# EasyEDA Pro project ProDocument_20LEDBarGraph_2024-07-22.epro

# Schematic Schematic1
Create Date: 2024-06-02; Page Name: P1; Project Name: 20BarLedGraph; Schematic Name: Schematic1; Update Date: 2024-06-02; Company: EasyEDA.com; Drawn: EasyEDA; Page Size: B4; Part Number: JLCPCB-002; Reviewed: EasyEDA; Version: V0.1
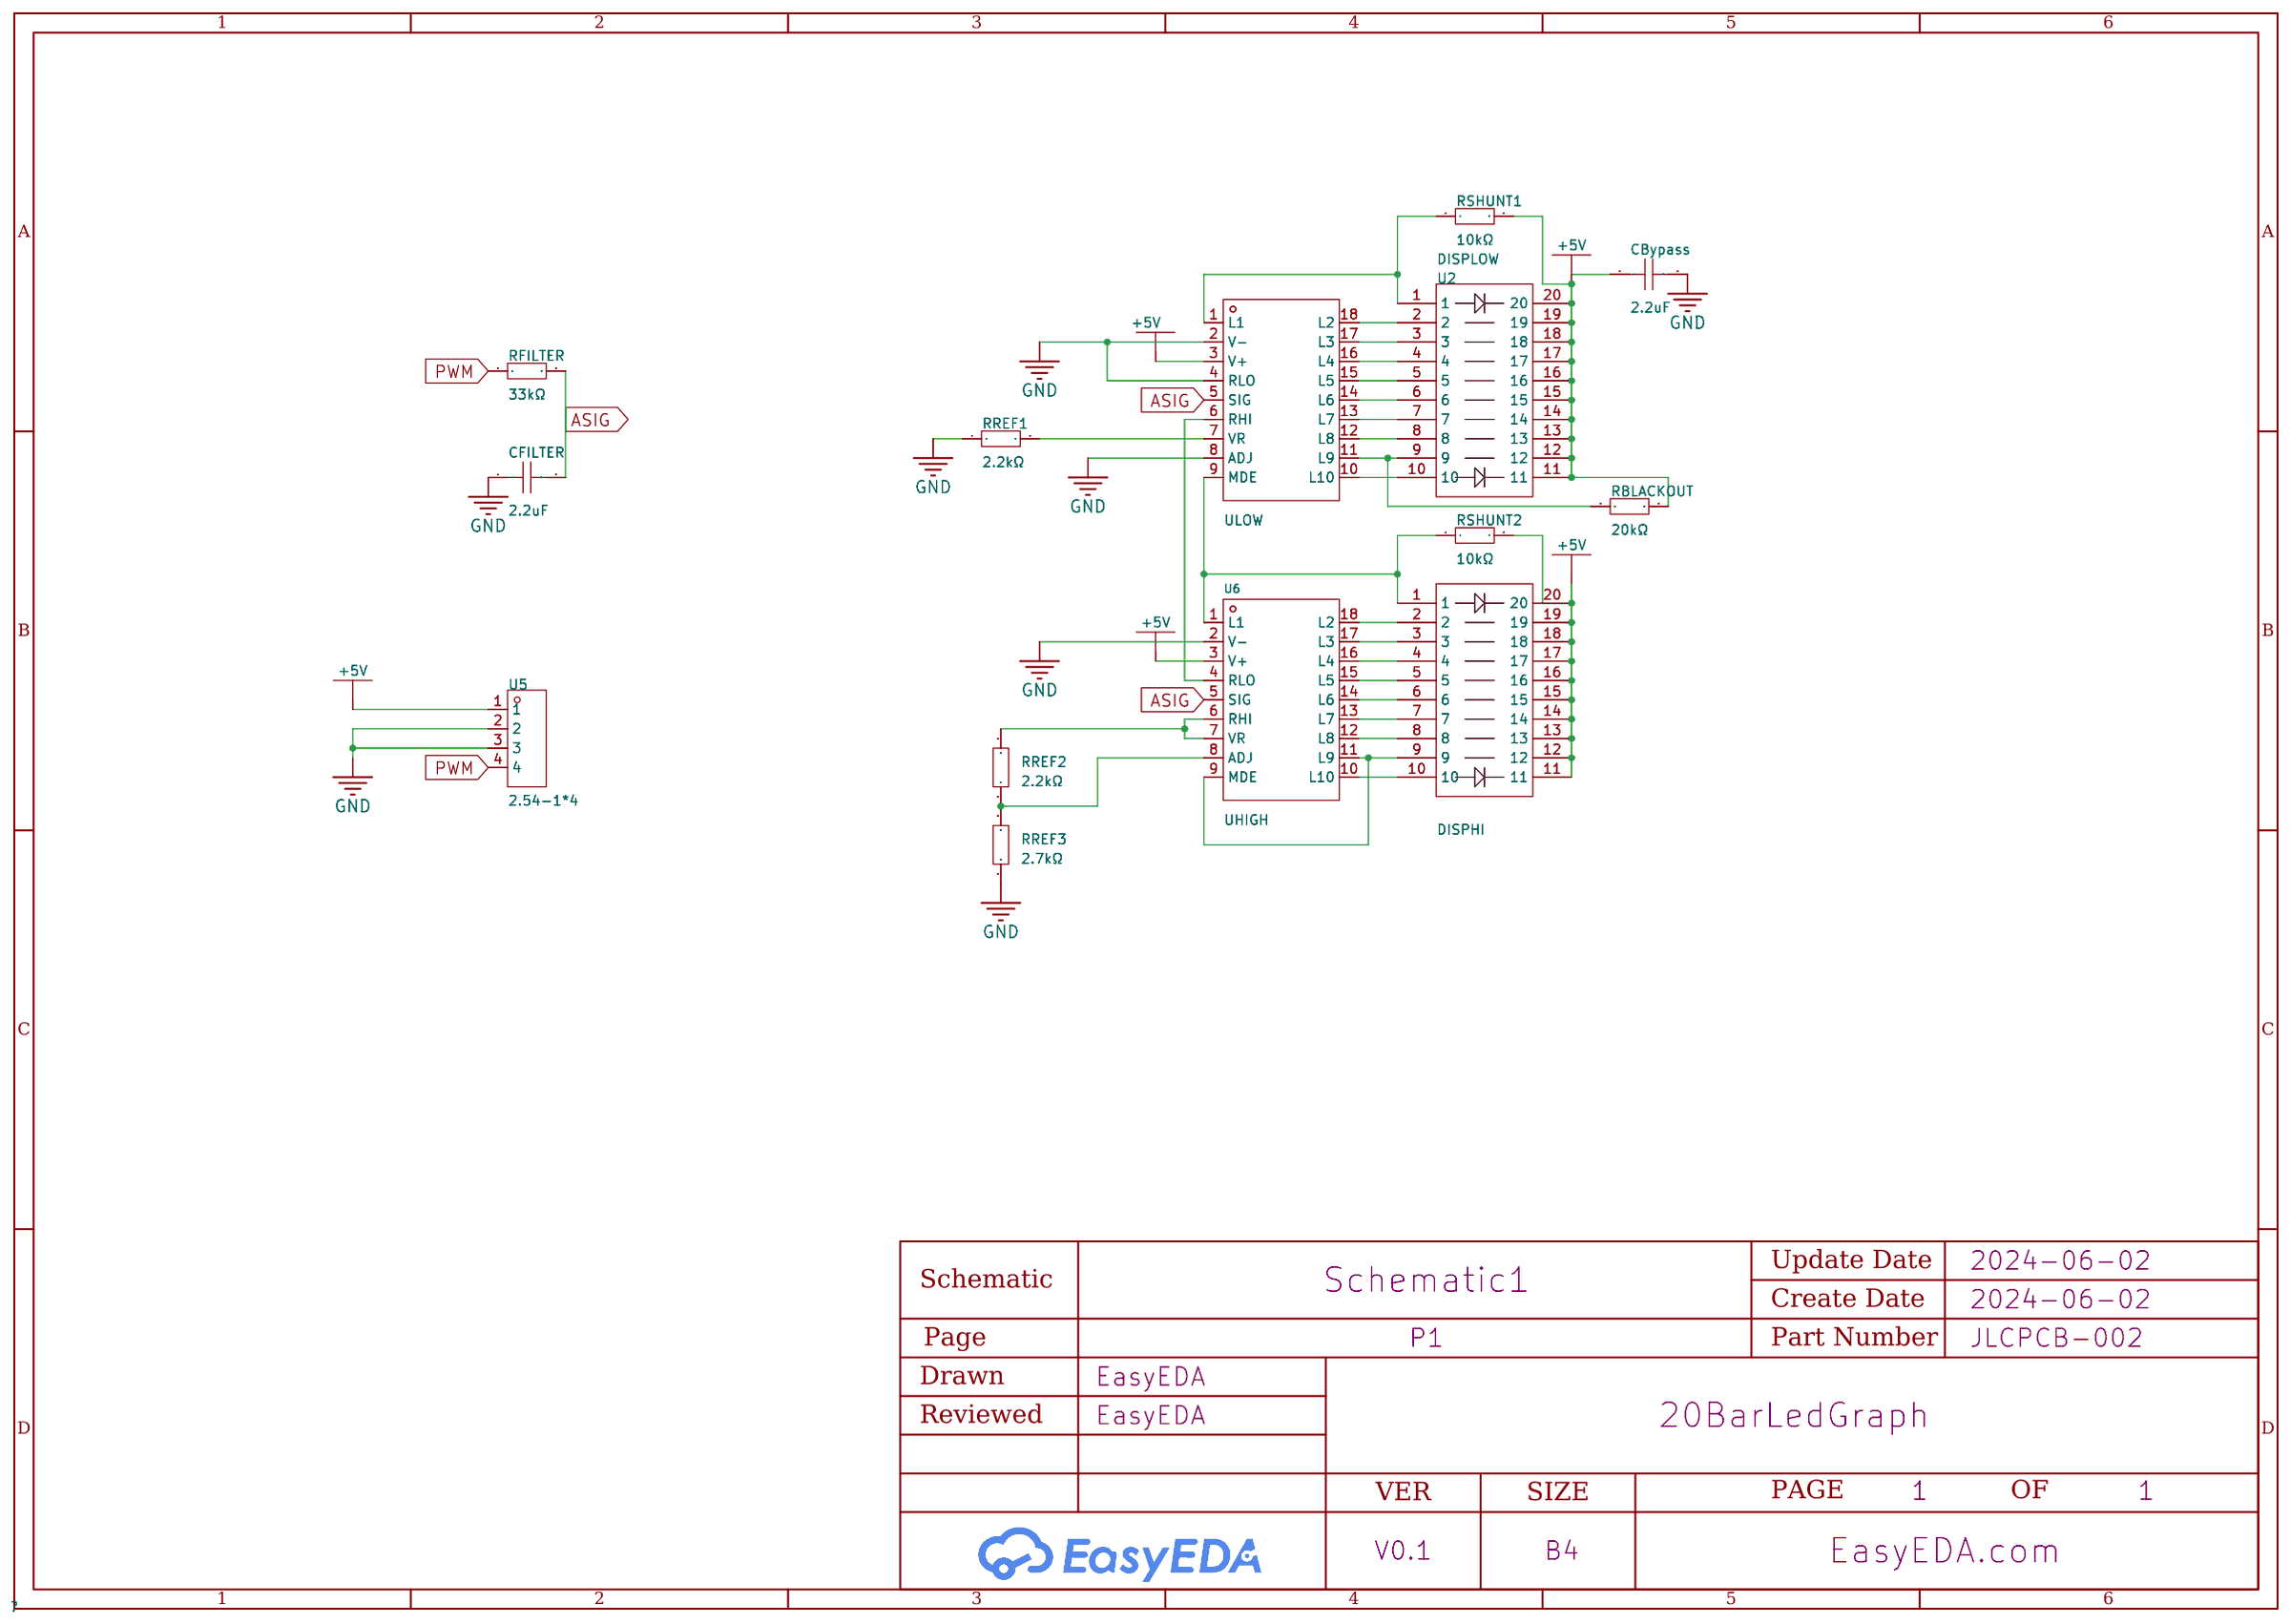
[diagram p0: schematic sheet]

## Parts
CBypass  2.2uF  [CAP-TH_L6.0-W3.8-P5.08-D0.6]
CFILTER  2.2uF  [CAP-TH_L6.0-W3.8-P5.08-D0.6]
RBLACKOUT  20kΩ  [R0805]
RFILTER  33kΩ  [R0805]
RREF1  2.2kΩ  [R0805]
RREF2  2.2kΩ  [R0805]
RREF3  2.7kΩ  [R0805]
RSHUNT1  10kΩ  [R0805]
RSHUNT2  10kΩ  [R0805]
U1  ULOW  [DIP-18_L23.0-W6.5-P2.54-LS7.6-BL]
U2  DISPLOW  [DC-10GWA]
U3  DISPHI  [DC-10GWA]
U5  2.54-1*4  [HDR-TH_4P-P2.54-V-M-1]
U6  UHIGH  [DIP-18_L23.0-W6.5-P2.54-LS7.6-BL]

## Library data of the parts
CBypass CFILTER = CD1H225KC9BER1F100: Capacitance:2.2uF Tolerance:±10% Tolerance:±10% Voltage Rated: Temperature Coefficient:; LCSC Part Name: 2.2uF ±10% 50V; Supplier Part: C2976626; Manufacturer: Dersonic(德尔创); Supplier Footprint: 插件,P=5.08mm; JLCPCB Part Class: Extended Part; Datasheet: https://atta.szlcsc.com/upload/public/pdf/source/20220304/197B0E1BA41BC065DA95B0B1D62A1A79.pdf; Supplier: LCSC; Tolerance: ±10%
RBLACKOUT RFILTER RREF1-RREF3 RSHUNT1 RSHUNT2 = RC0805JR-0733KL: Type:Thick Film Resistors Resistance: Tolerance:±5% Tolerance:±5% Power(Watts): Overload Voltage (Max): Temperature Coefficient:±100ppm/℃ Temperature Coefficient:±100ppm/℃ Operating Temperature Range:-55℃~+155℃ Operating Temperature Range:-55℃~+155℃; LCSC Part Name: 厚膜电阻 33kΩ ±5% 125mW; Supplier Part: C137446; Manufacturer: YAGEO(国巨); Supplier Footprint: 0805; JLCPCB Part Class: Extended Part; Datasheet: https://atta.szlcsc.com/upload/public/pdf/source/20180821/C275644_0D56F95EFF785E7D9A1FEF436B37DA78.pdf; Supplier: LCSC; Type: Thick Film Resistors; Tolerance: ±5%; Temperature Coefficient: ±100ppm/℃; Operating Temperature Range: -55℃~+155℃
U1 U6 = LM3914N-1/NOPB: LCSC Part Name: LM3914N-1/NOPB 停产; Supplier Part: C9408; Manufacturer: TI(德州仪器); Supplier Footprint: DIP-18; JLCPCB Part Class: Extended Part; Datasheet: https://atta.szlcsc.com/upload/public/pdf/source/20230921/1ED2EC5C4D10D36FCAAC69C54DEA4EED.pdf; Supplier: LCSC
U2 U3 = DC-10GWA
U5 = 2.54-1*4: Pin Structure:1x4P Pitch:2.54mm Number of Rows:Plugin Number of Pins:4P; Supplier Part: C5116483; Manufacturer: ZHOURI(洲日); Supplier Footprint: 插件,P=2.54mm; JLCPCB Part Class: Extended Part; Datasheet: https://atta.szlcsc.com/upload/public/pdf/source/20220729/BC3442D33C9CDBB7F5DC20B12A8605A8.pdf; Supplier: LCSC; Pin Structure: 1x4P; Pitch: 2.54mm; Number of Rows: Plugin; Number of Pins: 4P

## Nets
+5V: CBypass.1 RBLACKOUT.2 RSHUNT1.2 RSHUNT2.2 U1.3(V+) U2.11 U2.12 U2.13 U2.14 U2.15 U2.16 U2.17 U2.18 U2.19 U2.20 U3.11 U3.12 U3.13 U3.14 U3.15 U3.16 U3.17 U3.18 U3.19 U3.20 U5.1 U6.3(V+)
GND: CBypass.2 CFILTER.1 RREF1.1 RREF3.1 U1.2(V-) U1.4(RLO) U1.8(ADJ) U5.2 U5.3 U6.2(V-)
ASIG: CFILTER.2 RFILTER.2 U1.5(SIG) U6.5(SIG)
PWM: RFILTER.1 U5.4
$1N1093: U1.18(L2) U2.2
$1N1104: U1.17(L3) U2.3
$1N1110: U1.16(L4) U2.4
$1N1113: U1.15(L5) U2.5
$1N1116: U1.14(L6) U2.6
$1N1119: U1.13(L7) U2.7
$1N1122: U1.12(L8) U2.8
$1N1348: U3.2 U6.18(L2)
$1N1354: U3.3 U6.17(L3)
$1N1356: U3.4 U6.16(L4)
$1N1358: U3.5 U6.15(L5)
$1N1360: U3.6 U6.14(L6)
$1N1362: U3.7 U6.13(L7)
$1N1364: U3.8 U6.12(L8)
$1N1368: U3.10 U6.10(L10)
$1N1390: U1.10(L10) U2.10
$1N1718: U1.6(RHI) U6.4(RLO)
$1N1723: RREF1.2 U1.7(VR)
$1N1817: RREF2.2 U6.6(RHI) U6.7(VR)
$1N1828: RREF2.1 RREF3.2 U6.8(ADJ)
$1N1833: RBLACKOUT.1 U1.11(L9) U2.9
$1N1943: U3.9 U6.9(MDE) U6.11(L9)
$1N1991: RSHUNT1.1 U1.1(L1) U2.1
$1N2039: RSHUNT2.1 U1.9(MDE) U3.1 U6.1(L1)

# Board PCB1
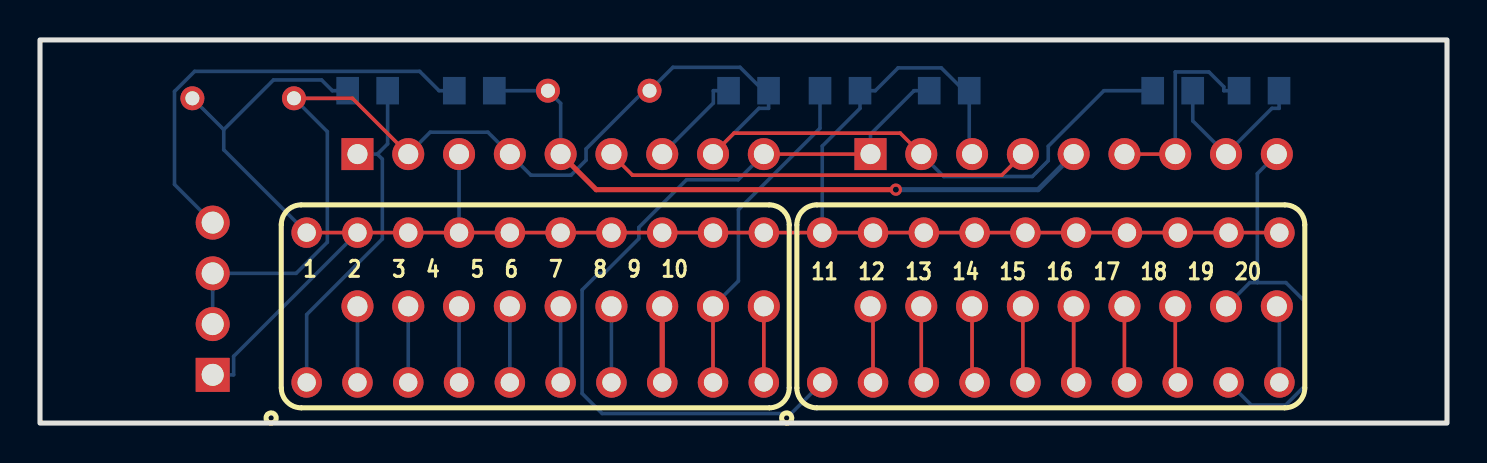
[diagram p1: board, top side]
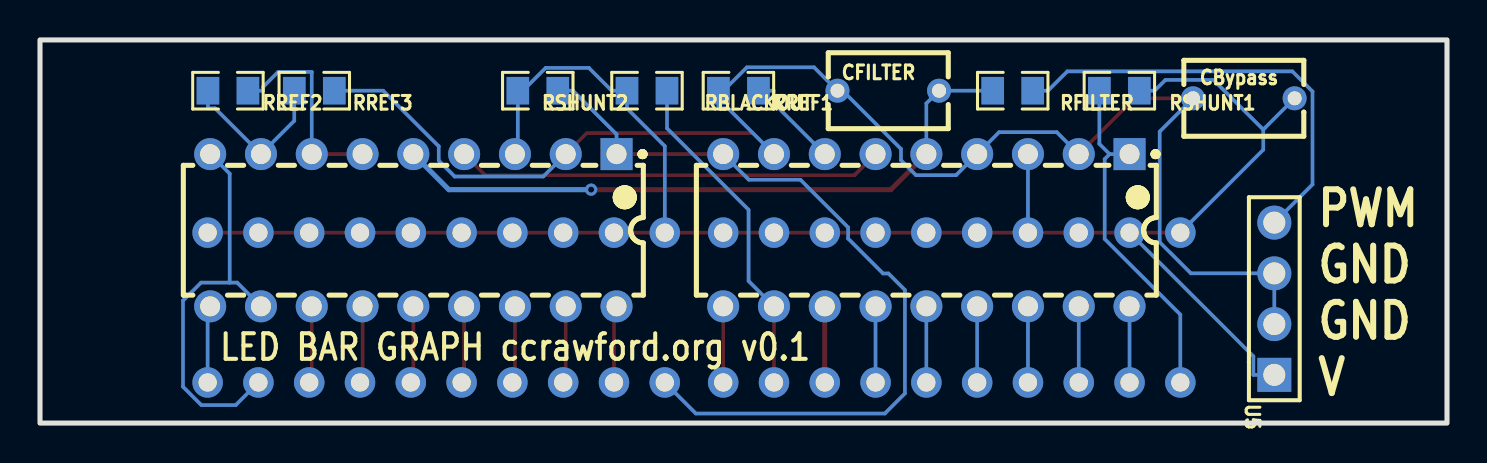
[diagram p2: board, bottom side, seen from below]

Outline 70.36 x 19.18 mm; copper layers: Top Layer, Bottom Layer. Coordinates in mm from the lower left corner of the outline.
Outline path: rectangle 0,19.18 70.36,0
Stack: Top Layer 0.035mm / Dielectric1 1.51mm FR4 er 4.5 / Bottom Layer 0.035mm

## Design rules (mm)
template: Custom Config
spacing copperThickness1oz (default): track to track 0.102, other pairs 0.152 to 0.3
spacing copperThickness2oz: track to track 0.203, other pairs 0.152 to 0.3
track width copperThickness1oz (default): min 0.127, default 0.18, max 2.54
track width copperThickness2oz: min 0.203, default 0.254, max 2.54
differential pair differentialPair (default): width min 0.127, default 0.254, max 2.54; gap min 0.152, default 0.152
via viaSize (default): diameter min 0.5, default 0.61, max 10; hole min 0.3, default 0.305, max 6.3

## Placement (name value [footprint] x y rotation side)
CBypass  2.2uF  [CAP-TH_L6.0-W3.8-P5.08-D0.6]  10.16 16.26 0 bottom
CFILTER  2.2uF  [CAP-TH_L6.0-W3.8-P5.08-D0.6]  27.94 16.64 180 bottom
RBLACKOUT  20kΩ  [R0805]  40 16.64 0 bottom
RFILTER  33kΩ  [R0805]  21.72 16.64 0 bottom
RREF1  2.2kΩ  [R0805]  35.43 16.64 180 bottom
RREF2  2.2kΩ  [R0805]  60.96 16.64 180 bottom
RREF3  2.7kΩ  [R0805]  56.64 16.64 0 bottom
RSHUNT1  10kΩ  [R0805]  16.38 16.64 180 bottom
RSHUNT2  10kΩ  [R0805]  45.47 16.64 0 bottom
U1  ULOW  [DIP-18_L23.0-W6.5-P2.54-LS7.6-BL]  26.03 9.65 0 bottom
U2  DISPLOW  [DC-10GWA]  36.19 2.03 90 top
U3  DISPHI  [DC-10GWA]  61.98 2.03 90 top
U5  2.54-1*4  [HDR-TH_4P-P2.54-V-M-1]  8.64 6.22 90 bottom
U6  UHIGH  [DIP-18_L23.0-W6.5-P2.54-LS7.6-BL]  51.69 9.65 0 bottom

## Footprints (pads in the part's own frame, mm; a bottom-side part is the same pattern mirrored in y, then rotated)
CAP-TH_L6.0-W3.8-P5.08-D0.6
  round 1.2 hole 0.7: 1(-2.54,0) 2(2.54,0)
DC-10GWA
  round 1.524 hole 0.914: 1(0,22.86) 2(0,20.32) 3(0,17.78) 4(0,15.24) 5(0,12.7) 6(0,10.16) 7(0,7.62) 8(0,5.08) 9(0,2.54) 10(0,0) 11(7.5,0) 12(7.5,2.54) 13(7.5,5.08) 14(7.5,7.62) 15(7.5,10.16) 16(7.5,12.7) 17(7.5,15.24) 18(7.5,17.78) 19(7.5,20.32) 20(7.5,22.86)
DIP-18_L23.0-W6.5-P2.54-LS7.6-BL
  rect 1.6x1.6 hole 1: 1(-10.16,-3.81)
  round 1.6 hole 1: 2(-7.62,-3.81) 3(-5.08,-3.81) 4(-2.54,-3.81) 5(0,-3.81) 6(2.54,-3.81) 7(5.08,-3.81) 8(7.62,-3.81) 9(10.16,-3.81) 10(10.16,3.81) 11(7.62,3.81) 12(5.08,3.81) 13(2.54,3.81) 14(0,3.81) 15(-2.54,3.81) 16(-5.08,3.81) 17(-7.62,3.81) 18(-10.16,3.81)
HDR-TH_4P-P2.54-V-M-1
  rect 1.7x1.7 hole 1.1: 1(-3.81,0)
  round 1.7 hole 1.1: 2(-1.27,0) 3(1.27,0) 4(3.81,0)
R0805
  rect 1.133x1.377 smd: 1(-1,0) 2(1,0)

## Nets
As in the schematic.

## Via types
v1: diameter 0.61, hole 0.305, Top Layer to Bottom Layer, 1 via

## Routing (per net, layer and track width the routed paths; a pad name or vN(x,y) marks a point on that pad's centre or on a via; arc(x,y) is an arc through that point)
+5V: length 97.4
  Top Layer w0.18: U3.11 U3.12 U3.13 U3.14 U3.15 U3.16 U3.17 U3.18 U3.19 U3.20 U2.11 U2.12 U2.13 U2.14 U2.15 U2.16 U2.17 U2.18 U2.19 U2.20
  Bottom Layer w0.18: U5.1 9.68,2.41 9.68,3.34 U2.19 ; RSHUNT1.2 14.62,16.64 14.08,17.18 11.68,17.18 9.19,14.69 ; CBypass.1 9.19,14.69 ; 9.19,14.69 9.19,13.68 U2.20 ; U3.20 39.12,13.86 41.01,15.75 RBLACKOUT.2 41.77,16.64 42.91,17.78 45.07,17.78 46.21,16.64 RSHUNT2.2 46.47,13.6 46.61,13.46 ; U2.17 U1.3
GND: length 76.2
  Top Layer w0.18: CBypass.2 15.62,16.26 U1.2 ; U1.8 34.7,14.51 43.02,14.51 44.07,13.46
  Bottom Layer w0.18: U1.2 19.51,14.56 22.4,14.56 U1.4 24.55,12.41 26.55,12.41 27.31,13.16 27.31,13.72 30.22,16.64 CFILTER.1 31.65,17.81 35.01,17.81 36.18,16.64 RREF1.1 36.43,15.75 35.95,15.75 U1.8 ; RREF3.1 53.2,16.64 50.42,13.86 50.42,13.14 49.62,12.34 45.19,12.34 44.07,13.46 ; CBypass.2 14.37,14.59 14.37,9.06 12.81,7.49 U5.3 U5.2
ASIG: length 33.2
  Top Layer w0.254: v1(42.8,11.68) 27.81,11.68 U1.5
  Bottom Layer w0.18: U1.5 26.03,16 CFILTER.2 RFILTER.2
  Bottom Layer w0.254: U6.5 49.91,11.68 v1(42.8,11.68)
PWM: length 22.2
  Bottom Layer w0.18: 20.72,16.64 19.95,16.64 18.99,17.6 7.73,17.6 6.73,16.6 6.73,11.94 U5.4
$1N1093: length 3.8
  Bottom Layer w0.18: U2.2 U1.18
$1N1104: length 3.8
  Bottom Layer w0.18: U2.3 U1.17
$1N1110: length 3.8
  Bottom Layer w0.18: U2.4 U1.16
$1N1113: length 3.8
  Bottom Layer w0.18: U2.5 U1.15
$1N1116: length 3.8
  Bottom Layer w0.18: U2.6 U1.14
$1N1119: length 3.8
  Bottom Layer w0.18: U2.7 U1.13
$1N1122: length 3.8
  Top Layer w0.254: U1.12 U2.8
$1N1348: length 3.9
  Top Layer w0.18: U3.2 41.66,5.72 U6.18
$1N1354: length 3.9
  Top Layer w0.18: 44.07,5.84 44.07,2.16 U3.3
$1N1356: length 3.9
  Top Layer w0.18: U3.4 46.61,2.16 46.61,5.84
$1N1358: length 3.9
  Top Layer w0.18: U3.5 49.15,2.16 U6.15
$1N1360: length 3.9
  Top Layer w0.18: U3.6 51.69,2.16 U6.14
$1N1362: length 3.9
  Top Layer w0.18: 54.23,5.84 54.23,2.16 U3.7
$1N1364: length 3.9
  Top Layer w0.18: U3.8 56.77,2.16 U6.12
$1N1368: length 3.9
  Bottom Layer w0.18: U6.10 61.98,5.72 U3.10
$1N1390: length 3.8
  Top Layer w0.18: U2.10 U1.10
$1N1718: length 21.4
  Top Layer w0.18: U1.6 29.63,12.41 48.09,12.41 U6.4
$1N1723: length 5
  Bottom Layer w0.18: 34.43,16.64 33.67,16.64 33.67,16.02 U1.7
$1N1817: length 10.3
  Top Layer w0.18: 54.23,13.46 U6.7
  Bottom Layer w0.18: U6.7 56.77,17.57 56.77,17.57 58.45,17.57 59.2,16.83 59.2,16.64 59.96,16.64
$1N1828: length 8.4
  Bottom Layer w0.18: RREF3.2 57.64,15.13 U6.8 61.6,15.75 61.96,15.75 61.96,16.64
$1N1833: length 16.8
  Top Layer w0.18: U2.9 U1.11
  Bottom Layer w0.18: U1.11 34.93,7.11 34.93,10.68 39,14.75 39,16.64
$1N1943: length 20.5
  Bottom Layer w0.18: 60.87,7.03 60.87,12.49 U6.9 ; 60.87,7.03 62.3,7.03 63.21,6.13 63.21,1.82 62.29,0.9 60.57,0.9 U3.9 ; 60.87,7.03 60.5,7.03 U6.11
$1N1991: length 17.5
  Bottom Layer w0.18: U2.1 13.34,5.43 17.12,9.22 17.12,13.21 16.87,13.46 ; 16.87,13.46 17.38,13.97 17.38,16.64 ; 16.87,13.46 U1.1
$1N2039: length 40.7
  Top Layer w0.18: U6.1 U1.9
  Bottom Layer w0.18: U6.1 41.53,14.46 43.7,16.63 43.7,16.64 RSHUNT2.1 ; U1.9 34.91,12.18 32.33,12.18 29.95,9.79 29.95,9.23 28.2,7.49 27.93,7.49 27.11,6.67 27.11,1.48 28.11,0.48 37.56,0.48 U3.1

## Text on the board
Bottom Silkscreen Layer: LED BAR GRAPH ccrawford.org v0.1 | PWM / GND / GND / V
Top Silkscreen Layer: 1   2   3  4   5  6   7   8  9  10 | 11  12  13  14  15  16  17  18  19  20
